# EAGLE schematic me433 (EAGLE 8.1.0)
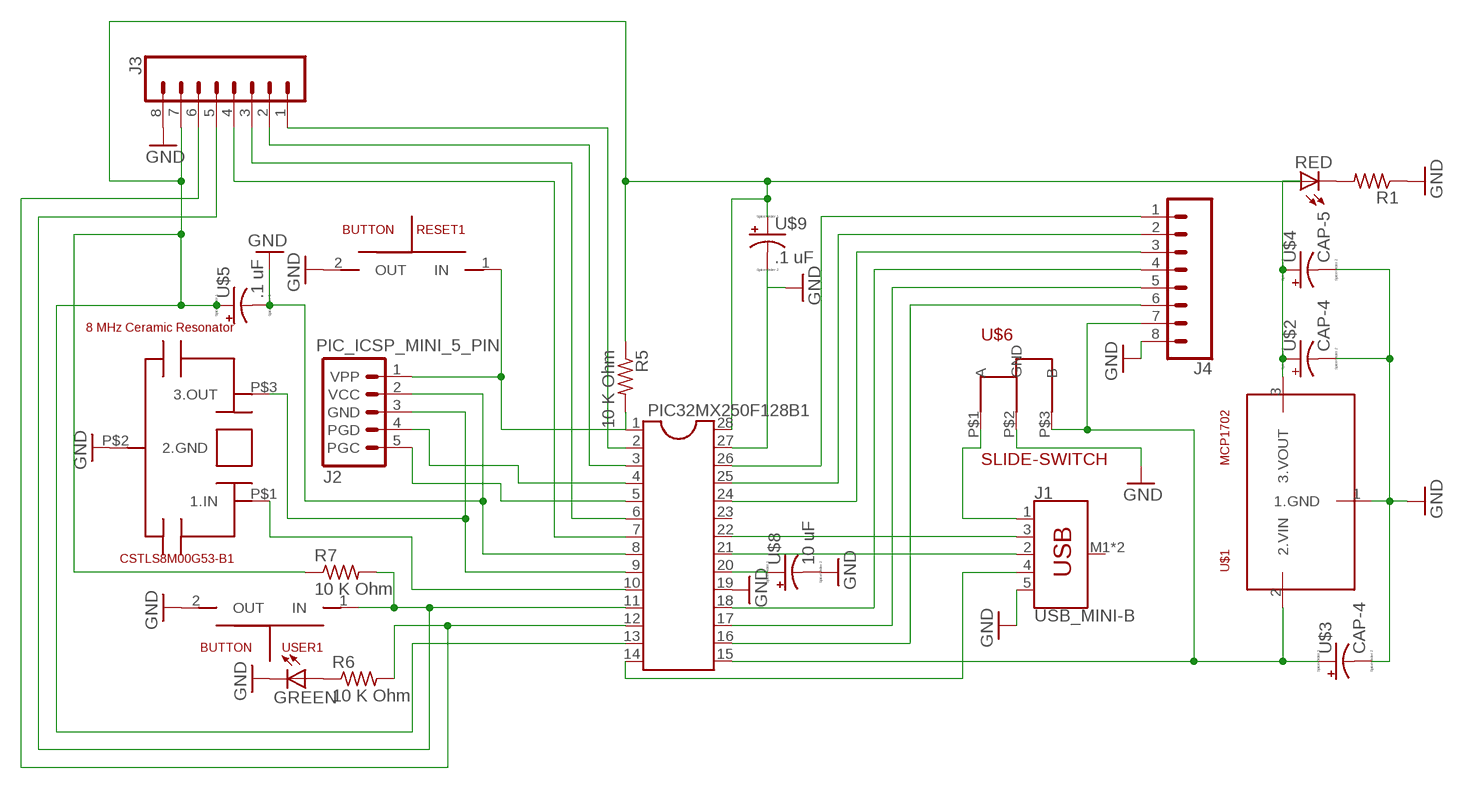
[diagram p0: schematic, sheet 1]

## Parts
CSTLS8M00G53-B1  8 MHz Ceramic Resonator  CSTLS8M00G53-B0  [CSTLS8M00G53-B0]
GREEN  LED3MM  [LED3MM]
J1  USB_MINI-B  [32005-601]
J2  PIC_ICSP_MINI_5_PIN  [PIC_ICSP_MINI_5_PIN]
J3  CONN_08"  [1X08]
J4  CONN_08"  [1X08]
PIC32MX250F128B1  DIL28-3  [DIL28-3]
R1  R-US_0207/10  [0207/10]
R5  10 K Ohm  R-US_0207/10  [0207/10]
R6  10 K Ohm  R-US_0207/10  [0207/10]
R7  10 K Ohm  R-US_0207/10  [0207/10]
RED  LED3MM  [LED3MM]
RESET1  BUTTON  [BUTTON]
U$1  MCP1702  [TO92]
U$2  CAP-4  [E1,8-4]
U$3  CAP-4  [E1,8-4]
U$4  CAP-5  [E2,5-5]
U$5  .1 uF  CAP-4  [E1,8-4]
U$6  SLIDE-SWITCH  [ALCOSWITCH]
U$8  10 uF  CAP-5  [E2,5-5]
U$9  .1 uF  CAP-4  [E1,8-4]
USER1  BUTTON  [BUTTON]

## Nets
GND: CSTLS8M00G53-B1.P$2(2.GND) GREEN.K(C) J1.5(GND) J2.2(VCC) J3.8 J4.8 PIC32MX250F128B1.8 PIC32MX250F128B1.19 R1.1 RESET1.2(OUT) U$1.1(1.GND) U$2.- U$3.- U$4.- U$5.- U$6.P$2(GND) U$8.- U$9.- USER1.2(OUT)
N$1: R1.2 RED.K(C)
N$2: CSTLS8M00G53-B1.P$3(3.OUT) J2.3(GND) PIC32MX250F128B1.9
N$3: CSTLS8M00G53-B1.P$1(1.IN) PIC32MX250F128B1.10
N$4: J4.7 PIC32MX250F128B1.15 U$1.2(2.VIN) U$3.+ U$6.P$3(B)
N$5: J1.2(D+) PIC32MX250F128B1.21
N$6: J3.7 PIC32MX250F128B1.13 PIC32MX250F128B1.28 R5.1 R7.1 RED.A U$1.3(3.VOUT) U$2.+ U$4.+ U$5.+ U$9.+
N$7: PIC32MX250F128B1.20 U$8.+
N$8: J2.4(PGD) PIC32MX250F128B1.4
N$9: GREEN.A R6.1
N$10: J3.3 PIC32MX250F128B1.6
N$11: J3.5 PIC32MX250F128B1.11 R7.2 USER1.1(IN)
N$12: J1.3(D-) PIC32MX250F128B1.22
N$13: J1.4(ID) PIC32MX250F128B1.14
N$14: J3.1 PIC32MX250F128B1.2
N$15: J2.5(PGC) PIC32MX250F128B1.5
N$16: J1.1(VBUS) U$6.P$1(A)
N$17: J4.6 PIC32MX250F128B1.16
N$19: J3.4 PIC32MX250F128B1.7
N$20: PIC32MX250F128B1.27
N$21: J3.6 PIC32MX250F128B1.12 R6.2
N$22: J4.1 PIC32MX250F128B1.26
N$23: J4.2 PIC32MX250F128B1.25
N$24: J4.3 PIC32MX250F128B1.24
N$26: J4.5 PIC32MX250F128B1.17
N$28: J4.4 PIC32MX250F128B1.18
N$29: J3.2 PIC32MX250F128B1.3
N$30: J2.1(VPP) R5.2 RESET1.1(IN)
Unconnected: J1.M1(SHIELD) J1.M2(SHIELD) PIC32MX250F128B1.1 PIC32MX250F128B1.23

## Library data of the parts
CSTLS8M00G53-B1 = ME433:CSTLS8M00G53-B0
GREEN RED = ME433:LED: LED OSRAM: - CHIPLED LG R971, LG N971, LY N971, LG Q971, LY Q971, LO R971, LY R971 LH N974, LH R974 LS Q976, LO Q976, LY Q976 LO Q996 - Hyper CHIPLED LW Q18S LB Q993, LB Q99A, LB R99A - SideLED LS A670, LO A670, LY A670, LG A670, LP A670 LB A673, LV A673, LT A673, LW A673 LH A674 LY A675 LS A676, LA A676, LO A676, LY A676, LW A676 LS A679, LY A679, LG A679 - Hyper Micro SIDELED® LS Y876, LA Y876, LO Y876, LY Y876 LT Y87S - SmartLED LW L88C, LW L88S LB L89C, LB L89S, LG L890 LS L89K, LO L89K, LY L89K LS L896, LA L896, LO L896, LY L896 - TOPLED LS T670, LO T670, LY T670, LG T670, LP T670 LSG T670, LSP T670, LSY T670, LOP T670, LYG T670 LG T671, LOG T671, LSG T671 LB T673, LV T673, LT T673, LW T673 LH T674 LS T676, LA T676, LO T676, LY T676, LB T676, LH T676, LSB T676, LW T676 LB T67C, LV T67C, LT T67C, LS T67K, LO T67K, LY T67K, LW E67C LS E67B, LA E67B, LO E67B, LY E67B, LB E67C, LV E67C, LT E67C LW T67C LS T679, LY T679, LG T679 LS T770, LO T770, LY T770, LG T770, LP T770 LB T773, LV T773, LT T773, LW T773 LH T774 LS E675, LA E675, LY E675, LS T675 LS T776, LA T776, LO T776, LY T776, LB T776 LHGB T686 LT T68C, LB T68C - Hyper Mini TOPLED® LB M676 - Mini TOPLED Santana® LG M470 LS M47K, LO M47K, LY M47K Source: http://www.osram.convergy.de LUXEON: - LUMILED® LXK2-PW12-R00, LXK2-PW12-S00, LXK2-PW14-U00, LXK2-PW14-V00 LXK2-PM12-R00, LXK2-PM12-S00, LXK2-PM14-U00 LXK2-PE12-Q00, LXK2-PE12-R00, LXK2-PE12-S00, LXK2-PE14-T00, LXK2-PE14-U00 LXK2-PB12-K00, LXK2-PB12-L00, LXK2-PB12-M00, LXK2-PB14-N00, LXK2-PB14-P00, LXK2-PB14-Q00 LXK2-PR12-L00, LXK2-PR12-M00, LXK2-PR14-Q00, LXK2-PR14-R00 LXK2-PD12-Q00, LXK2-PD12-R00, LXK2-PD12-S00 LXK2-PH12-R00, LXK2-PH12-S00 LXK2-PL12-P00, LXK2-PL12-Q00, LXK2-PL12-R00 Source: www.luxeon.com KINGBRIGHT: KA-3528ASYC Source: www.kingbright.com
J1 = ME433:USB_MINI-B: USB type Mini-B Connector Breaks out 5th pin, and includes shield pins if needed. SparkFun Products: SparkFun FTDI Basic Breakout <https://www.sparkfun.com/products/9716> SparkFun XBee Explorer USB <https://www.sparkfun.com/products/11812> SparkFun Redboard <https://www.sparkfun.com/products/12757>
J2 = SparkFun-Connectors:PIC_ICSP_MINI_5_PIN: PIC-ICSP-Mini Miniature 5-pin connection for temporary programming of PICs. Use this device in your design to save space. Miniature ISCP Programming connector for PICs This 5 pin header contains all the lines necessary for programming most PIC microcontrollers. Use this device in your design to save space. Here is the connector we sell at SparkFun: 5-Pin Mini ICSP Connector <https://www.sparkfun.com/products/11264> (PRT-11264) It is used on these SparkFun products: USB Bit Whacker - 18F2553 Development Board <https://www.sparkfun.com/products/762> (DEV-00762) SparkFun Serial Enabled LCD Backpack <https://www.sparkfun.com/products/258> (LCD-00258) Also, if you need a nice PIC programmer, please check these out: MPLAB PICkit 3 <https://www.sparkfun.com/products/9973> (PGM-09973); PROD_ID: CONN-08314; SF_ID: PRT-11264
J3 J4 = ME433:CONN_08: Multi connection point. Often used as Generic Header-pin footprint for 0.1 inch spaced/style header connections On any of the 0.1 inch spaced packages, you can populate with these: Break Away Headers - Straight <https://www.sparkfun.com/products/116> (PRT-00116) Break Away Male Headers - Right Angle <https://www.sparkfun.com/products/553> (PRT-00553) Female Headers <https://www.sparkfun.com/products/115> (PRT-00115) Break Away Headers - Machine Pin <https://www.sparkfun.com/products/117> (PRT-00117) Break Away Female Headers - Swiss Machine Pin <https://www.sparkfun.com/products/743> (PRT-00743) Arduino Stackable Header - 8 Pin <https://www.sparkfun.com/products/9279> (PRT-09279) For SCREWTERMINALS and SPRING TERMINALS visit here: Screw Terimnals on SparkFun.com <https://www.sparkfun.com/search/results?term=Screw+Terminals> (5mm/3.5mm/2.54mm spacing) This device is also useful as a general connection point to wire up your design to another part of your project. Our various solder wires solder well into these plated through hole pads. Hook-Up Wire - Assortment (Stranded, 22 AWG) <https://www.sparkfun.com/products/11375> (PRT-11375) Hook-Up Wire - Assortment (Solid Core, 22 AWG) <https://www.sparkfun.com/products/11367> (PRT-11367) View the entire wire category on our website here <https://www.sparkfun.com/categories/141> Special notes: Molex polarized connector foot print use with SKU : PRT-08231 with associated crimp pins and housings. 1MM SMD Version SKU: PRT-10208 NOTES ON THE VARIANTS LOCK and LOCK_LONGPADS... This footprint was designed to help hold the alignment of a through-hole component (i.e. 6-pin header) while soldering it into place. You may notice that each hole has been shifted either up or down by 0.005 of an inch from it's more standard position (which is a perfectly straight line). This slight alteration caused the pins (the squares in the middle) to touch the edges of the holes. Because they are alternating, it causes a "brace" to hold the component in place. 0.005 has proven to be the perfect amount of "off-center" position when using our standard breakaway headers. Although looks a little odd when you look at the bare footprint, once you have a header in there, the alteration is very hard to notice. Also,if you push a header all the way into place, it is covered up entirely on the bottom side.; PROD_ID: CONN-08438
PIC32MX250F128B1 = ME433:DIL28: Dual In Line
R1 R5-R7 = ME433:R-US_: RESISTOR, American symbol
RESET1 USER1 = ME433:BUTTON
U$1 = ME433:MCP1702
U$2 U$3 U$5 U$9 = ME433:CAP-4
U$4 U$8 = ME433:CAP-5
U$6 = ME433:SLIDE-SWITCH